# EAGLE schematic DrivePDU (EAGLE 9.1.3)
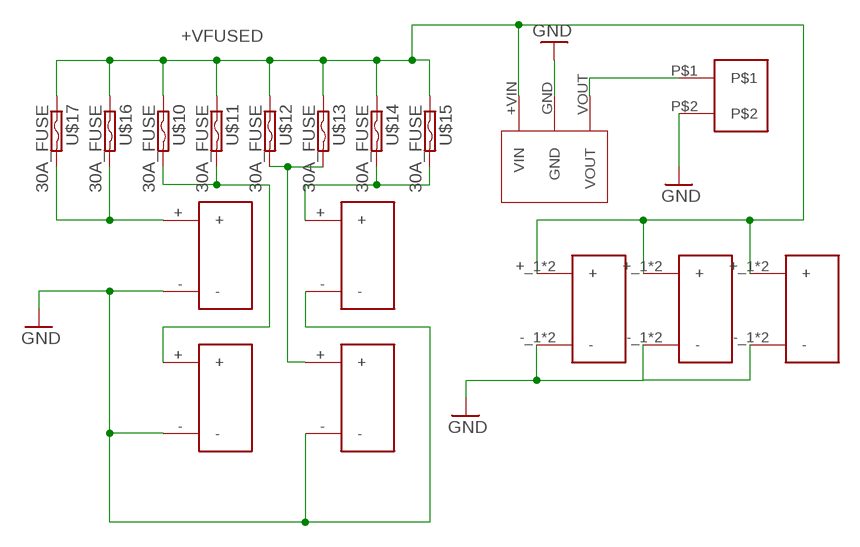
[diagram p0: schematic, sheet 1]

## Parts
U$1  PP45_HOR_4GRD  [PP45_HOR_4GRD]
U$2  PP45_HOR_4GRD  [PP45_HOR_4GRD]
U$3  PP45_HOR_4GRD  [PP45_HOR_4GRD]
U$4  PP45_HOR_2BOT  [PP45_HOR_2BOT]
U$5  PP45_HOR_2BOT  [PP45_HOR_2BOT]
U$6  PP45_HOR_2BOT  [PP45_HOR_2BOT]
U$7  PP45_HOR_2BOT  [PP45_HOR_2BOT]
U$8  AMP-MTE-2MALE  [AMP-MTE-2MALE]
U$9  R-78E3.3-0.5  [R-78E3.3-0.5]
U$10  30A_FUSE  [01220090Z]
U$11  30A_FUSE  [01220090Z]
U$12  30A_FUSE  [01220090Z]
U$13  30A_FUSE  [01220090Z]
U$14  30A_FUSE  [01220090Z]
U$15  30A_FUSE  [01220090Z]
U$16  30A_FUSE  [01220090Z]
U$17  30A_FUSE  [01220090Z]

## Nets
+VFUSED: U$1.+_1(+) U$1.+_2(+) U$2.+_1(+) U$2.+_2(+) U$3.+_1(+) U$3.+_2(+) U$9.+VIN(VIN) U$10.P$1 U$10.P$2 U$11.P$1 U$11.P$2 U$12.P$1 U$12.P$2 U$13.P$1 U$13.P$2 U$14.P$1 U$14.P$2 U$15.P$1 U$15.P$2 U$16.P$1 U$16.P$2 U$17.P$1 U$17.P$2
GND: U$1.-_1(-) U$1.-_2(-) U$2.-_1(-) U$2.-_2(-) U$3.-_1(-) U$3.-_2(-) U$4.- U$5.- U$6.- U$7.- U$8.P$2 U$9.GND
N$2: U$8.P$1 U$9.VOUT
N$3: U$4.+ U$10.P$3 U$10.P$4 U$11.P$3 U$11.P$4
N$4: U$7.+ U$16.P$3 U$16.P$4 U$17.P$3 U$17.P$4
N$5: U$5.+ U$14.P$3 U$14.P$4 U$15.P$3 U$15.P$4
N$6: U$6.+ U$12.P$3 U$12.P$4 U$13.P$3 U$13.P$4

## Library data of the parts
U$1-U$3 = SPEAR:PP45_HOR_4GRD
U$4-U$7 = SPEAR:PP45_HOR_2BOT
U$8 = SPEAR:AMP-MTE-2MALE
U$9 = SPEAR-PDU:R-78E3.3-0.5
U$10-U$17 = SPEAR-PDU:30A_FUSE